# EAGLE schematic schematicv2 (EAGLE 8.4.3)
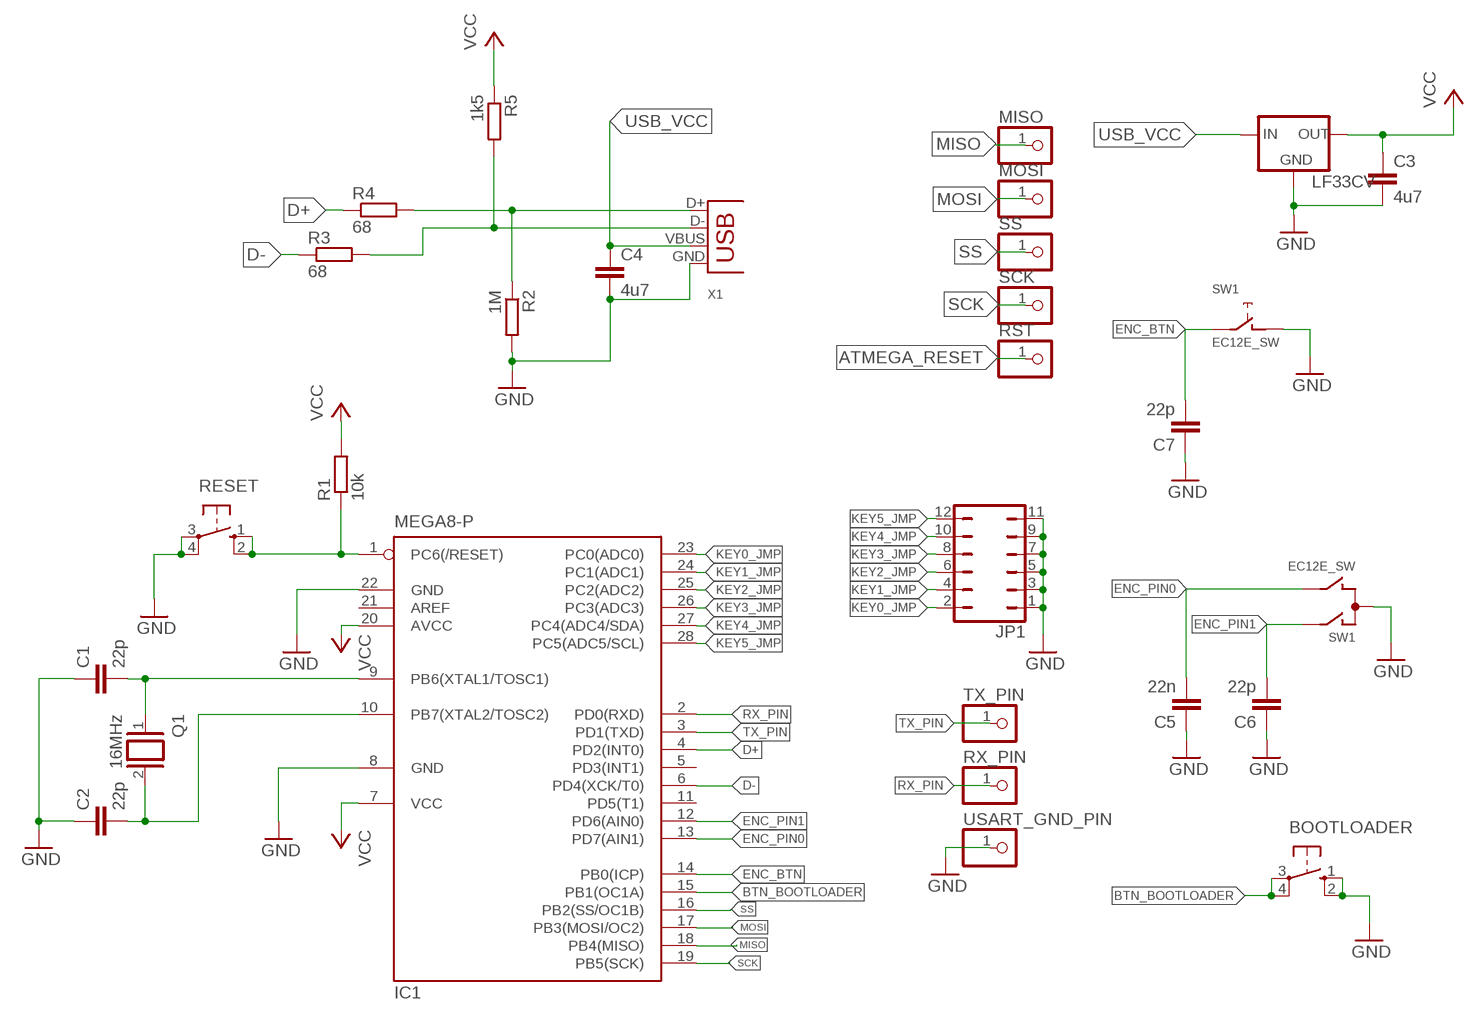
[diagram p0: schematic, sheet 1]

## Parts
BOOTLOADER  10-XX  [B3F-10XX]
C1  22p  C5/5  [C5B5]
C2  22p  C5/5  [C5B5]
C3  4u7  C5/3  [C5B3]
C4  4u7  C5/3  [C5B3]
C5  22n  C5/5  [C5B5]
C6  22p  C5/5  [C5B5]
C7  22p  C5/5  [C5B5]
IC1  MEGA8-P  [DIL28-3]
JP1  JP6Q  [JP6Q]
LF33CV  LFXXCVS  [TO220S]
MISO  PINHD-1X1  [1X01]
MOSI  PINHD-1X1  [1X01]
Q1  16MHz  XTAL/S  [QS]
R1  10k  R-EU_0309/V  [0309V]
R2  1M  R-EU_0204/7  [0204/7]
R3  68  R-EU_0204/7  [0204/7]
R4  68  R-EU_0204/7  [0204/7]
R5  1k5  R-EU_0204/7  [0204/7]
RESET  10-XX  [B3F-10XX]
RST  PINHD-1X1  [1X01]
RX_PIN  PINHD-1X1  [1X01]
SCK  PINHD-1X1  [1X01]
SS  PINHD-1X1  [1X01]
SW1  EC12E_SW  [ALPS_EC12E_SW]
TX_PIN  PINHD-1X1  [1X01]
USART_GND_PIN  PINHD-1X1  [1X01]
X1  USB-B-H  [USB-B-H]

## Nets
ATMEGA_RESET: IC1.1(PC6(/RESET)) R1.1 RESET.1(S) RESET.2(S1) RST.1
BTN_BOOTLOADER: BOOTLOADER.3(P) BOOTLOADER.4(P1) IC1.15(PB1(OC1A))
D+: IC1.4(PD2(INT0)) R4.1
D-: IC1.6(PD4(XCK/T0)) R3.1
ENC_BTN: C7.2 IC1.14(PB0(ICP)) SW1.E
ENC_PIN0: C5.2 IC1.13(PD7(AIN1)) SW1.B
ENC_PIN1: C6.2 IC1.12(PD6(AIN0)) SW1.A
GND: BOOTLOADER.1(S) BOOTLOADER.2(S1) C1.1 C2.1 C3.2 C4.2 C5.1 C6.1 C7.1 IC1.8(GND) IC1.22(GND) JP1.1 JP1.3 JP1.5 JP1.7 JP1.9 JP1.11 LF33CV.2(GND) R2.2 RESET.3(P) RESET.4(P1) SW1.C SW1.D USART_GND_PIN.1 X1.GND
KEY0_JMP: IC1.23(PC0(ADC0)) JP1.2
KEY1_JMP: IC1.24(PC1(ADC1)) JP1.4
KEY2_JMP: IC1.25(PC2(ADC2)) JP1.6
KEY3_JMP: IC1.26(PC3(ADC3)) JP1.8
KEY4_JMP: IC1.27(PC4(ADC4/SDA)) JP1.10
KEY5_JMP: IC1.28(PC5(ADC5/SCL)) JP1.12
MISO: IC1.18(PB4(MISO)) MISO.1
MOSI: IC1.17(PB3(MOSI/OC2)) MOSI.1
N$1: C1.2 IC1.9(PB6(XTAL1/TOSC1)) Q1.1
N$2: C2.2 IC1.10(PB7(XTAL2/TOSC2)) Q1.2
N$4: R2.1 R4.2 X1.D+
N$5: R3.2 R5.2 X1.D-
RX_PIN: IC1.2(PD0(RXD)) RX_PIN.1
SCK: IC1.19(PB5(SCK)) SCK.1
SS: IC1.16(PB2(SS/OC1B)) SS.1
TX_PIN: IC1.3(PD1(TXD)) TX_PIN.1
USB_VCC: C4.1 LF33CV.1(IN) X1.VBUS
VCC: C3.1 IC1.7(VCC) IC1.20(AVCC) LF33CV.3(OUT) R1.2 R5.1
Unconnected: IC1.5(PD3(INT1)) IC1.11(PD5(T1)) IC1.21(AREF) SW1.GND1(G) SW1.GND2(G)

## Library data of the parts
BOOTLOADER RESET = switch-omron:10-XX: OMRON SWITCH; MPN: B3F-1000; OC_FARNELL: 176432; OC_NEWARK: 36M3542
C1-C7 = capacitor-wima:C: CAPACITOR naming: grid - package width
IC1 = atmel:MEGA8-P: MICROCONTROLLER 8 Kbytes FLASH, 1 kbytes SRAM, 512 bytes EEPROM, USART, 4-channel 10 bit ADC, 2-channel 8 bit ADC Pin compatible with Atmega48, ATMega88, ATMega168 Source: avr.lbr; OC_FARNELL: unknown; OC_NEWARK: unknown
JP1 = jumper:JP6Q: JUMPER
LF33CV = lf33:LFXXCV: VOLTAGE REGULATOR
MISO MOSI RST RX_PIN SCK SS TX_PIN USART_GND_PIN = pinhead:PINHD-1X1: PIN HEADER
Q1 = special:XTAL/S: CRYSTAL
R1-R5 = resistor:R-EU_: RESISTOR, European symbol
SW1 = switch-alps:EC12E_SW: ALPS rotary Encoder EC12E series with switch
X1 = con-usb-3:USB: USB Connectors